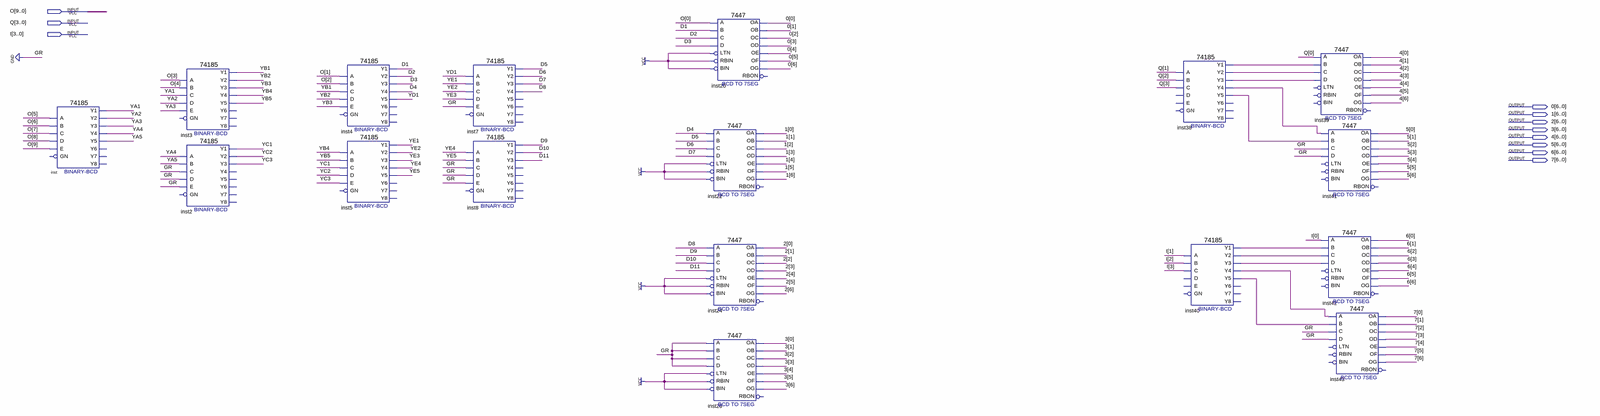
[diagram p0: schematic sheet, whole]
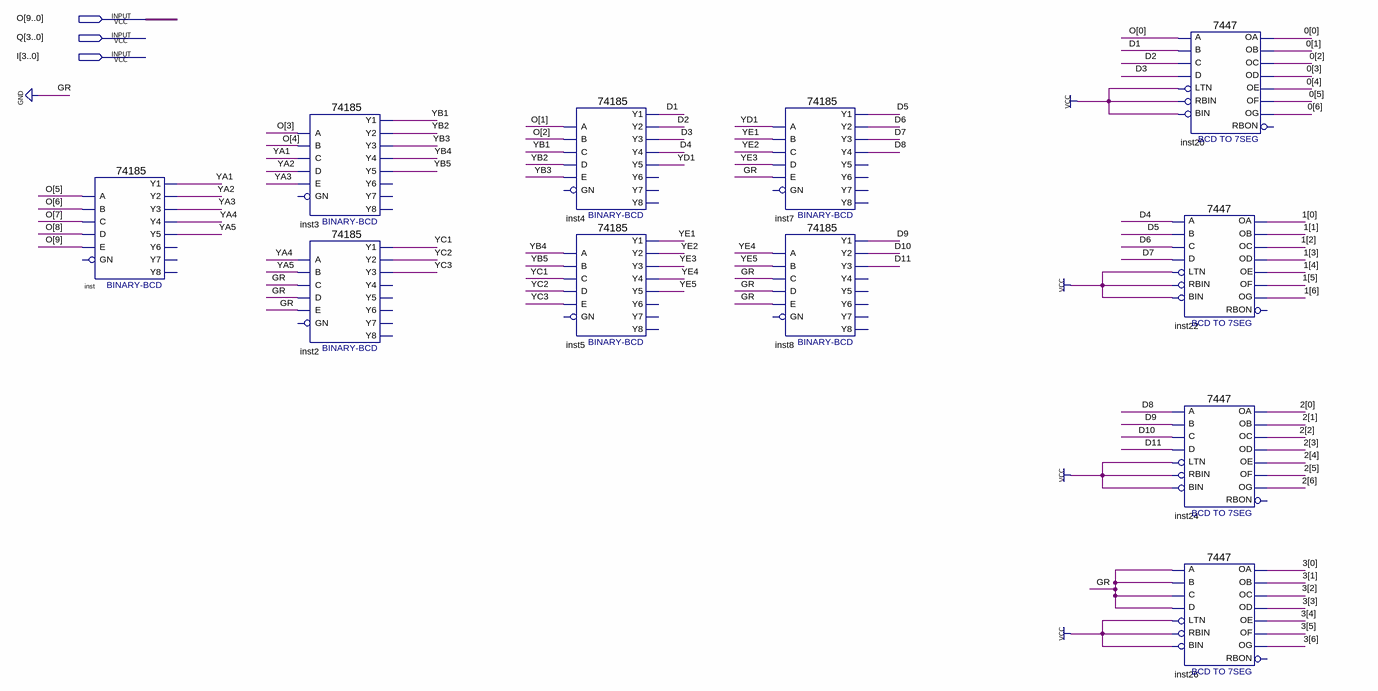
[diagram p1: schematic sheet, left part]
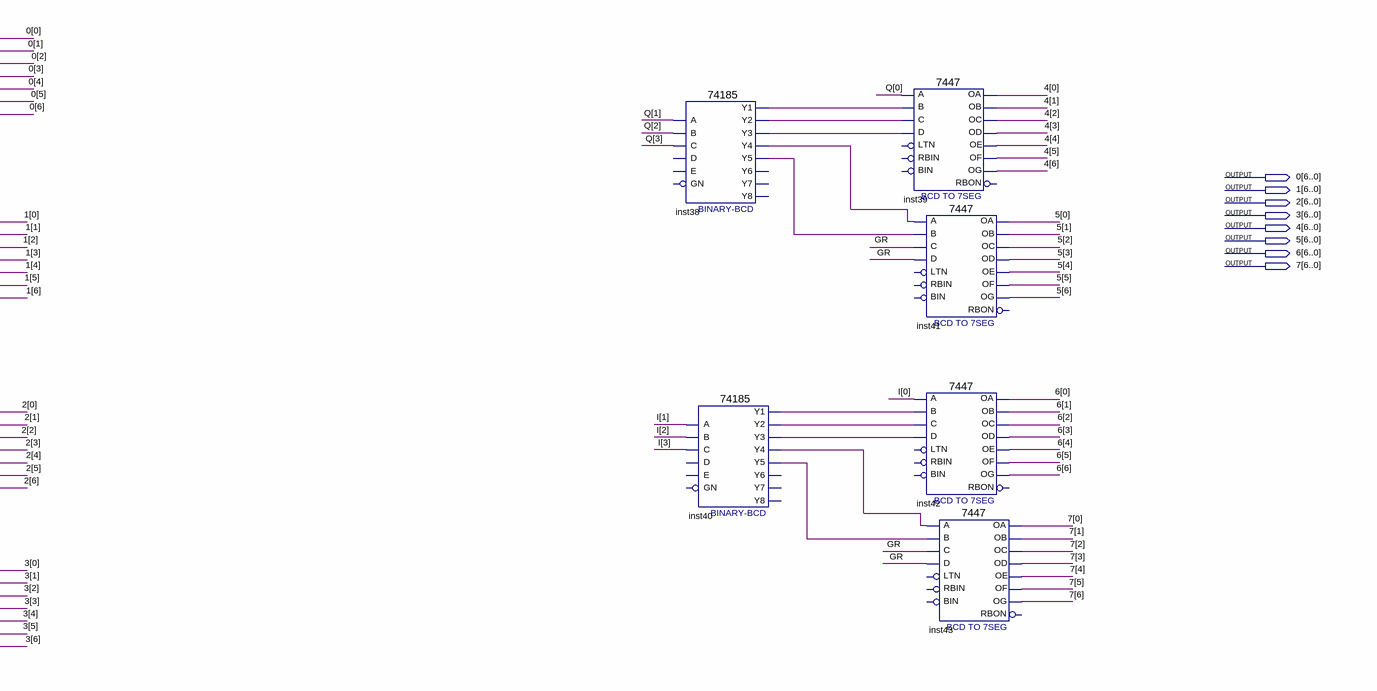
[diagram p2: schematic sheet, right part]
// Quartus schematic hex0to7.bdf as structural Verilog: 17 symbols, 11 pins
module hex0to7 (
  input  [9:0] O,
  input  [3:0] Q,
  input  [3:0] I,
  output [6:0] \0 ,
  output [6:0] \1 ,
  output [6:0] \2 ,
  output [6:0] \3 ,
  output [6:0] \4 ,
  output [6:0] \5 ,
  output [6:0] \6 ,
  output [6:0] \7 
);

  wire D1, D2, D3, D4, D5, D6, D7, D8, D9, D10, D11, inst38_y1, inst38_y2, inst38_y3, inst38_y4, inst38_y5,
       inst40_y1, inst40_y2, inst40_y3, inst40_y4, inst40_y5, YA1, YA2, YA3, YA4, YA5, YB1, YB2, YB3, YB4,
       YB5, YC1, YC2, YC3, YD1, YE1, YE2, YE3, YE4, YE5;

  \74185  inst (
    .A(O[5]), .B(O[6]), .D(O[8]), .C(O[7]), .E(O[9]), .Y1(YA1), .Y3(YA3), .Y2(YA2), .Y5(YA5), .Y4(YA4));  // open: GN, Y6, Y8, Y7
  \74185  inst3 (
    .A(O[3]), .B(O[4]), .D(YA2), .C(YA1), .E(YA3), .Y1(YB1), .Y3(YB3), .Y2(YB2), .Y5(YB5), .Y4(YB4));  // open: GN, Y6, Y8, Y7
  \74185  inst2 (
    .A(YA4), .B(YA5), .D(1'b0), .C(1'b0), .E(1'b0), .Y1(YC1), .Y3(YC3), .Y2(YC2));  // open: GN, Y5, Y4, Y6, Y8, Y7
  \74185  inst4 (
    .A(O[1]), .B(O[2]), .D(YB2), .C(YB1), .E(YB3), .Y1(D1), .Y3(D3), .Y2(D2), .Y5(YD1), .Y4(D4));  // open: GN, Y6, Y8, Y7
  \74185  inst5 (
    .A(YB4), .B(YB5), .D(YC2), .C(YC1), .E(YC3), .Y1(YE1), .Y3(YE3), .Y2(YE2), .Y5(YE5), .Y4(YE4));  // open: GN, Y6, Y8, Y7
  \74185  inst7 (
    .A(YD1), .B(YE1), .D(YE3), .C(YE2), .E(1'b0), .Y1(D5), .Y3(D7), .Y2(D6), .Y4(D8));  // open: GN, Y5, Y6, Y8, Y7
  \74185  inst8 (
    .A(YE4), .B(YE5), .D(1'b0), .C(1'b0), .E(1'b0), .Y1(D9), .Y3(D11), .Y2(D10));  // open: GN, Y5, Y4, Y6, Y8, Y7
  \7447  inst20 (
    .LTN(1'b1), .B(D1), .C(D2), .D(D3), .RBIN(1'b1), .BIN(1'b1), .A(O[0]), .OB(\0 [1]), .OC(\0 [2]),
    .OE(\0 [4]), .OD(\0 [3]), .OF(\0 [5]), .OG(\0 [6]), .OA(\0 [0]));  // open: RBON
  \7447  inst22 (
    .LTN(1'b1), .B(D5), .C(D6), .D(D7), .RBIN(1'b1), .BIN(1'b1), .A(D4), .OB(\1 [1]), .OC(\1 [2]),
    .OE(\1 [4]), .OD(\1 [3]), .OF(\1 [5]), .OG(\1 [6]), .OA(\1 [0]));  // open: RBON
  \7447  inst24 (
    .LTN(1'b1), .B(D9), .C(D10), .D(D11), .RBIN(1'b1), .BIN(1'b1), .A(D8), .OB(\2 [1]), .OC(\2 [2]),
    .OE(\2 [4]), .OD(\2 [3]), .OF(\2 [5]), .OG(\2 [6]), .OA(\2 [0]));  // open: RBON
  \7447  inst26 (
    .LTN(1'b1), .B(1'b0), .C(1'b0), .D(1'b0), .RBIN(1'b1), .BIN(1'b1), .A(1'b0), .OB(\3 [1]), .OC(\3 [2]),
    .OE(\3 [4]), .OD(\3 [3]), .OF(\3 [5]), .OG(\3 [6]), .OA(\3 [0]));  // open: RBON
  \74185  inst38 (
    .A(Q[1]), .B(Q[2]), .C(Q[3]), .Y1(inst38_y1), .Y3(inst38_y3), .Y2(inst38_y2), .Y5(inst38_y5),
    .Y4(inst38_y4));  // open: D, E, GN, Y6, Y8, Y7
  \74185  inst40 (
    .A(I[1]), .B(I[2]), .C(I[3]), .Y1(inst40_y1), .Y3(inst40_y3), .Y2(inst40_y2), .Y5(inst40_y5),
    .Y4(inst40_y4));  // open: D, E, GN, Y6, Y8, Y7
  \7447  inst39 (
    .B(inst38_y1), .C(inst38_y2), .D(inst38_y3), .A(Q[0]), .OB(\4 [1]), .OC(\4 [2]), .OE(\4 [4]),
    .OD(\4 [3]), .OF(\4 [5]), .OG(\4 [6]), .OA(\4 [0]));  // open: LTN, RBIN, BIN, RBON
  \7447  inst41 (
    .B(inst38_y5), .C(1'b0), .D(1'b0), .A(inst38_y4), .OB(\5 [1]), .OC(\5 [2]), .OE(\5 [4]), .OD(\5 [3]),
    .OF(\5 [5]), .OG(\5 [6]), .OA(\5 [0]));  // open: LTN, RBIN, BIN, RBON
  \7447  inst42 (
    .B(inst40_y1), .C(inst40_y2), .D(inst40_y3), .A(I[0]), .OB(\6 [1]), .OC(\6 [2]), .OE(\6 [4]),
    .OD(\6 [3]), .OF(\6 [5]), .OG(\6 [6]), .OA(\6 [0]));  // open: LTN, RBIN, BIN, RBON
  \7447  inst43 (
    .B(inst40_y5), .C(1'b0), .D(1'b0), .A(inst40_y4), .OB(\7 [1]), .OC(\7 [2]), .OE(\7 [4]), .OD(\7 [3]),
    .OF(\7 [5]), .OG(\7 [6]), .OA(\7 [0]));  // open: LTN, RBIN, BIN, RBON
endmodule
